# Altium project Balance_car.PrjPcb
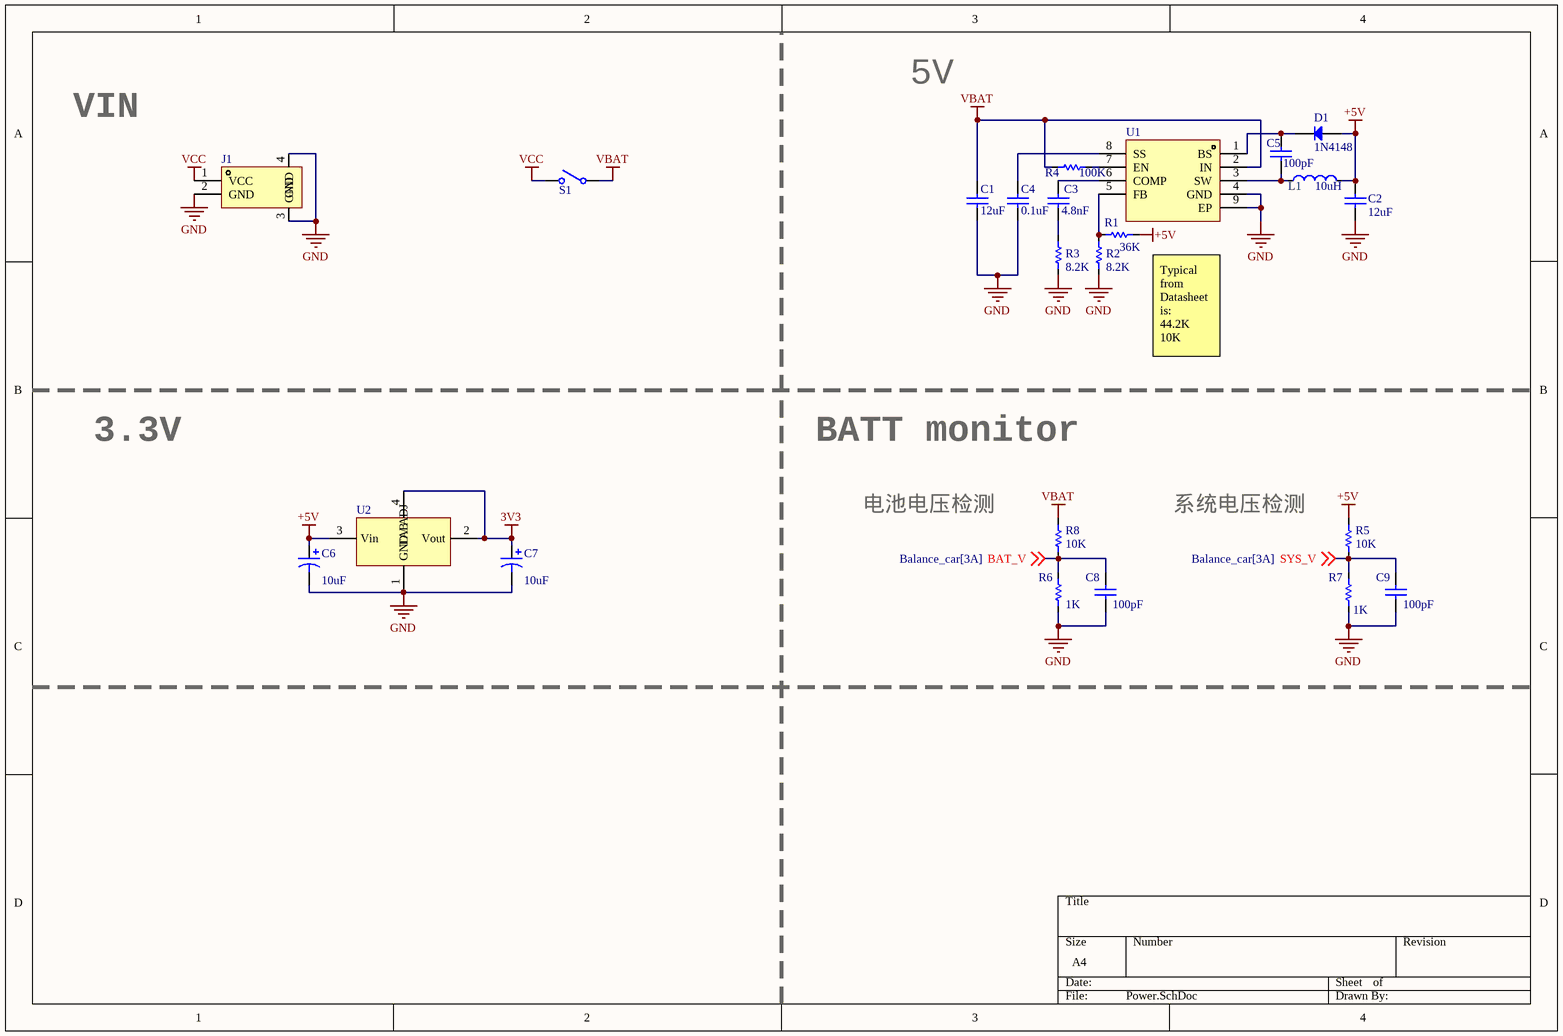
[diagram p0: Power.SchDoc]
2 sheets, 46 parts. Net scope: global (net labels, ports and power ports of the same name join across sheets).
Board file: Balance_car.PcbDoc
Sheets:
  Power.SchDoc
  Balance_car.SchDoc

## Sheet Power.SchDoc
size A4; SheetNumber: 1; SheetTotal: 2

### Parts
C1  value 12uF  [C1206]  (hidden comment: Cap)
C2  value 12uF  [C1206]  (hidden comment: Cap)
C3  value 4.8nF  [C0603]  (hidden comment: Cap)
C4  value 0.1uF  [C0603]  (hidden comment: Cap)
C5  value 100pF  [C0603]  (hidden comment: Cap)
C6  value 10uF  [CAP-SMD_BD4.0-L4.3-W4.3-FD-LS5.3]  (hidden comment: Cap Pol)
C7  value 10uF  [CAP-SMD_BD4.0-L4.3-W4.3-FD-LS5.3]  (hidden comment: Cap Pol)
C8  value 100pF  [C0603]  (hidden comment: Cap)
C9  value 100pF  [C0603]  (hidden comment: Cap)
D1  1N4148  [SOD-123F]
J1  XT60PW-M  [XT60PW-M]  (value not drawn)
L1  10uH  [IND-SMD_L7.3-W6.6]
R1  value 36K  [R0402]  (hidden comment: Res)
R2  value 8.2K  [R0402]  (hidden comment: Res)
R3  value 8.2K  [R0603]  (hidden comment: Res)
R4  value 100K  [R0603]  (hidden comment: Res)
R5  value 10K  [R0402]  (hidden comment: Res)
R6  value 1K  [R0402]  (hidden comment: Res)
R7  value 1K  [R0402]  (hidden comment: Res)
R8  value 10K  [R0402]  (hidden comment: Res)
S1  SW-PB  [SW-PB]  (value not drawn)
U1  MP2307  [MP2307]  (value not drawn)
U2  1117  [SOT-223-3]  (value not drawn)

### Nets
3V3: C7.1 U2.2(Vout) U2.4(TAB)
+5V: C2.1 C6.1 D1.2(A) L1.2 R1.1 R5.1 U2.3(Vin)
GND: C1.1 C2.2 C4.1 C6.2 C7.2 C8.2 C9.2 J1.2(GND) J1.3(GND) J1.4(GND) R2.1 R3.1 R6.2 R7.2 U1.4(GND) U1.9(EP) U2.1(GND_/_ADJ)
VBAT: C1.2 R4.1 R8.1 S1.1(COMMON) U1.2(IN)
VCC: J1.1(VCC) S1.2(NO)
BAT_V: C8.1 R6.1 R8.2 ; off-sheet BAT_V
SYS_V: C9.1 R5.2 R7.1 ; off-sheet SYS_V
NetC3_1: C3.1 R3.2
NetC3_2: C3.2 U1.6(COMP)
NetC4_2: C4.2 U1.8(SS)
NetC5_1: C5.1 L1.1 U1.3(SW)
NetC5_2: C5.2 D1.1(K) U1.1(BS)
NetR1_2: R1.2 R2.2 U1.5(FB)
NetR4_2: R4.2 U1.7(EN)

### Notes on the sheet
- 5V
- VIN
- (near R1) Typical from Datasheet is:
  44.2K    10K
- 3.3V
- BATT monitor
- 电池电压检测
- 系统电压检测

### Library data of the parts
C1-C5 C8 C9 = Cap: Capacitor; Published: 8-Jun-2000; LatestRevisionDate: 17-Jul-2002; LatestRevisionNote: Re-released for DXP Platform.; PackageReference: RAD-0.3; Publisher: Altium Limited; PackageDescription: Radial Cap, Thru-Hole; 2 Leads; 0.3 in Pin Spacing
C6 C7 = Cap Pol: Polarized Capacitor (Axial); Published: 8-Jun-2000; LatestRevisionDate: 17-Jul-2002; LatestRevisionNote: Re-released for DXP Platform.; PackageReference: POLAR0.8; Publisher: Altium Limited; PackageDescription: Polarized Capacitor; 2 Leads
D1 = 1N4148: High Conductance Fast Diode; Published: 8-Jun-2000; LatestRevisionDate: 17-Jul-2002; LatestRevisionNote: Re-released for DXP Platform.; DatasheetVersion: 1997; PackageReference: DO-35; Publisher: Altium Limited; PackageDescription: Diode, Axial; Body 3.8 x 1.9 mm (LxDia. max), Lead Dia. 0.53 mm (max); Code_JEDEC: DO-204-AH; ComponentLink1Description: Manufacturer Link; ComponentLink1URL: http://www.fairchildsemi.com/; ComponentLink2Description: Datasheet; ComponentLink2URL: http://www.fairchildsemi.com/ds/1N%2F1N4148.pdf
L1 = IND-SMD_L7.3-W6.6: 电感值:10uH;精度:±20%;额定电流:4A;饱和电流(Isat):5.5A;直流电阻(DCR):62mΩ;; Manufacturer: PSA(信昌电陶); Symbol: MCS0630-100MPY1; Add into BOM: yes; Tolerance: ±20%; Rated Current: 4A; Saturation Current (Isat): 5.5A; DC Resistance (DCR): 62mΩ; Name: 10uH; Device: MCS0630-100MPY1; LCSC Part Name: 10uH ±20% 4A 62mΩ; Supplier Part: C2937094; Manufacturer Part: MCS0630-100MPY1; Supplier Footprint: 0630; JLCPCB Part Class: Extended Part; Datasheet: https://atta.szlcsc.com/upload/public/pdf/source/20220121/EA6E6E6F70ED7BAE67EC293805EAAACB.pdf; Supplier: LCSC; Convert to PCB: yes; Value: 10uH
R1-R8 = Res: Resistor; Published: 8-Jun-2000; LatestRevisionDate: 17-Jul-2002; LatestRevisionNote: Re-released for DXP Platform.; PackageReference: AXIAL-0.3; Publisher: Altium Limited; PackageDescription: Axial Device, Thru-Hole; 2 Leads; 0.3 in Pin Spacing
S1 = SW-PB: 船型开关; Published: 24-Mar-1999; LatestRevisionDate: 17-Jul-2002; LatestRevisionNote: Re-released for DXP Platform.; PackageReference: SPST-2; Publisher: Altium Limited; PackageDescription: Switch; 2 Leads

## Sheet Balance_car.SchDoc
size A4; SheetNumber: 2; SheetTotal: 2
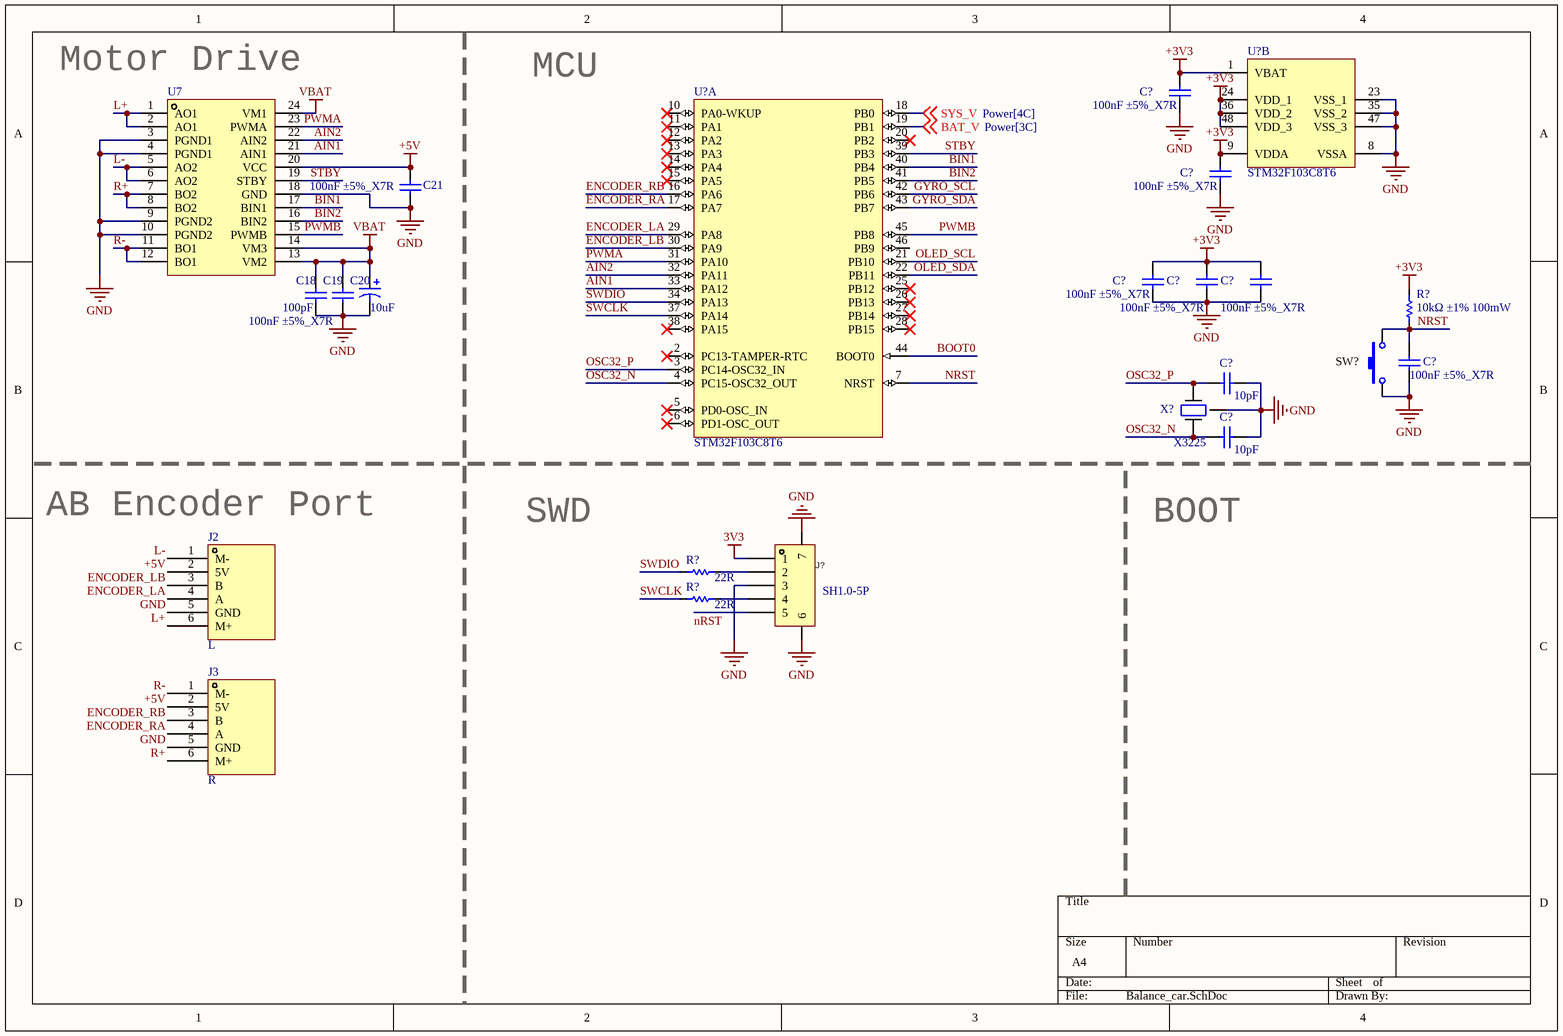
[diagram p1: Balance_car.SchDoc]

### Parts
(Parts that share a designator on the sheet are numbered #1, #2 ... from top to bottom, then left to right.)
C18  value 100pF  [C0603]  (hidden comment: Cap)
C19  100nF ±5%_X7R  [C0603]
C20  value 10uF  [CAP-SMD_L3.5-W2.8-R-RD]  (hidden comment: Cap Pol)
C21  100nF ±5%_X7R  [C0603]
C?#1  100nF ±5%_X7R  [C0603]
C?#2  100nF ±5%_X7R  [C0603]
C?#3  100nF ±5%_X7R  [C0603]
C?#4  100nF ±5%_X7R  [C0603]
C?#5  100nF ±5%_X7R  [C0603]
C?#6  100nF ±5%_X7R  [C0603]
C?#7  value 10pF  [C0603]  (hidden comment: Cap)
C?#8  value 10pF  [C0603]  (hidden comment: Cap)
J2  L  [AB_Encoder]
J3  R  [AB_Encoder]
J?  SH1.0-5P  [SM05B-SRSS-TB-LF-SN]
R?#1  10kΩ ±1% 100mW  [R0603]
R?#2  22R  [R0402]
R?#3  22R  [R0402]
SW?  TS-1185-B-A-B-A  [SW-SMD_L4.0-W3.0-LS5.0]  (value not drawn)
U7  TB6612FNG  [SSOP-24_L8.3-W5.6-P0.65-LS7.6-BL]  (value not drawn)
U?#1  STM32F103C8T6  [STM-LQFP48_N]  (part B of 2)
U?#2  STM32F103C8T6  [STM-LQFP48_N]  (part A of 2)
X?  X3225  [CRYSTAL_3225]

### Nets
3V3: J?.1
+3V3: C?#1.2 C?#2.2 C?#3.2 C?#4.2 C?#5.2 R?#1.2 U?#1.1(VBAT) U?#1.9(VDDA) U?#1.24(VDD_1) U?#1.36(VDD_2) U?#1.48(VDD_3)
+5V: C21.2 J2.2(5V) J3.2(5V) U7.20(VCC)
GND: C18.1 C19.1 C20.2 C21.1 C?#1.1 C?#2.1 C?#3.1 C?#4.1 C?#5.1 C?#6.1 C?#7.1 C?#8.1 J2.5(GND) J3.5(GND) J?.3 J?.6 J?.7 SW?.1 U7.3(PGND1) U7.4(PGND1) U7.9(PGND2) U7.10(PGND2) U7.18(GND) U?#1.8(VSSA) U?#1.23(VSS_1) U?#1.35(VSS_2) U?#1.47(VSS_3) X?.G
VBAT: C18.2 C19.2 C20.1 U7.13(VM2) U7.14(VM3) U7.24(VM1)
AIN1: U7.21(AIN1) U?#2.33(PA12)
AIN2: U7.22(AIN2) U?#2.32(PA11)
BAT_V: U?#2.19(PB1) ; off-sheet BAT_V
BIN1: U7.17(BIN1) U?#2.40(PB4)
BIN2: U7.16(BIN2) U?#2.41(PB5)
BOOT0: U?#2.44(BOOT0)
ENCODER_LA: J2.4(A) U?#2.29(PA8)
ENCODER_LB: J2.3(B) U?#2.30(PA9)
ENCODER_RA: J3.4(A) U?#2.17(PA7)
ENCODER_RB: J3.3(B) U?#2.16(PA6)
GYRO_SCL: U?#2.42(PB6)
GYRO_SDA: U?#2.43(PB7)
L+: J2.6(M+) U7.1(AO1) U7.2(AO1)
L-: J2.1(M-) U7.5(AO2) U7.6(AO2)
NRST: C?#6.2 J?.5 R?#1.1 SW?.2 U?#2.7(NRST)
OLED_SCL: U?#2.21(PB10)
OLED_SDA: U?#2.22(PB11)
OSC32_N: C?#8.2 U?#2.4(PC15-OSC32_OUT) X?.1
OSC32_P: C?#7.2 U?#2.3(PC14-OSC32_IN) X?.3
PWMA: U7.23(PWMA) U?#2.31(PA10)
PWMB: U7.15(PWMB) U?#2.45(PB8)
R+: J3.6(M+) U7.7(BO2) U7.8(BO2)
R-: J3.1(M-) U7.11(BO1) U7.12(BO1)
STBY: U7.19(STBY) U?#2.39(PB3)
SWCLK: R?#3.2 U?#2.37(PA14)
SWDIO: R?#2.2 U?#2.34(PA13)
SYS_V: U?#2.18(PB0) ; off-sheet SYS_V
NetJ?_2: J?.2 R?#2.1
NetJ?_4: J?.4 R?#3.1

Not connected (* = marked no-connect by the designer): U?#2 2(PC13-TAMPER-RTC)* 5(PD0-OSC_IN)* 6(PD1-OSC_OUT)* 10(PA0-WKUP)* 11(PA1)* 12(PA2)* 13(PA3)* 14(PA4)* 15(PA5)* 20(PB2)* 25(PB12)* 26(PB13)* 27(PB14)* 28(PB15)* 38(PA15)* 46(PB9)

### Notes on the sheet
- (near U7) Motor Drive
- MCU
- (near J2) AB Encoder Port
- SWD
- BOOT

### Library data of the parts
C18 C19 C21 C?#1-C?#8 = Cap: Capacitor; Published: 8-Jun-2000; LatestRevisionDate: 17-Jul-2002; LatestRevisionNote: Re-released for DXP Platform.; PackageReference: RAD-0.3; Publisher: Altium Limited; PackageDescription: Radial Cap, Thru-Hole; 2 Leads; 0.3 in Pin Spacing
C20 = Cap Pol: Polarized Capacitor (Axial); Published: 8-Jun-2000; LatestRevisionDate: 17-Jul-2002; LatestRevisionNote: Re-released for DXP Platform.; PackageReference: POLAR0.8; Publisher: Altium Limited; PackageDescription: Polarized Capacitor; 2 Leads
J2 J3 = AB_Encoder: 带编码器 TT马达
J? = SH1.0-5P: CONN-SMD_5P-P1.25_532610571-2; Manufacturer: BOOMELE(博穆精密); Name: GH1.25-5PLTPZ; Add into BOM: yes; Symbol: GH1.25-5PLTPZ; Device: GH1.25-5PLTPZ; LCSC Part Name: GH1.25-5P立贴编带加盖; Supplier Part: C2829263; Manufacturer Part: GH1.25-5PLTPZ; Supplier Footprint: -; JLCPCB Part Class: Extended Part; Datasheet: https://atta.szlcsc.com/upload/public/pdf/source/20211125/08A09A4909F58AF780B71FE423A00F7E.pdf; Supplier: LCSC; Convert to PCB: yes
R?#1-R?#3 = Res: Resistor; Published: 8-Jun-2000; LatestRevisionDate: 17-Jul-2002; LatestRevisionNote: Re-released for DXP Platform.; PackageReference: AXIAL-0.3; Publisher: Altium Limited; PackageDescription: Axial Device, Thru-Hole; 2 Leads; 0.3 in Pin Spacing
SW? = Button: 触点电流：50mA 额定电压(DC)：12V 电路结构：单刀单掷 安装方式：立贴 带灯：无 作用力：160gf 机械寿命：10万次 带支架：否 轻触开关3x4x2贴片2脚小龟 160gf; Manufacturer: XKB Connectivity(中国星坤); Add into BOM: yes; Contact Current: 50mA; Voltage Rating (DC): 12V; Circuit: 单刀单掷; Actuator Style: 圆形按钮; Actuator/Cap Color: 黑色; With Lamp: 无; Mechanical Life: 10万次; Switch Length: 4mm; Switch Width: 3mm; Switch Height: 2mm; Strike Gundam: 否; Name: TS-1185-B-A-B-A; Symbol: TS-1185-B-A-B-A; Device: TS-1185-B-A-B-A; LCSC Part Name: 4*3*2mm 立贴 轻触开关; Supplier Part: C561517; Manufacturer Part: TS-1185-B-A-B-A; Supplier Footprint: SMD; JLCPCB Part Class: Extended Part; Datasheet: https://atta.szlcsc.com/upload/public/pdf/source/20211011/C2F26DC0AE1820400F54DBF49644F5A1.pdf; Supplier: LCSC; Convert to PCB: yes; Insulation Resistance: -; Mounting Style: 立贴; Operating Force: 160gf; Operating Temperature: -30℃~+85℃
U7 = TB6612FNG: Driver IC for Dual DC motor / SSOP24-P-300-0.65A
U?#1 U?#2 = STM32F103C8T6: ARM Cortex-M3 32-bit MCU, 64 KB Flash, 20 KB Internal RAM, 37 I/Os, 48-pin LQFP, -40 to 85 degC, Tray; A/D Converter: 2x12-bit (10 Channel); FLASH Size (Prog) (kB): 64; I/Os (High Current): 37; Internal RAM Size (kB): 20; Operating Frequency(F) (Processor speed) (MHz): 72; Supply Voltage(Vcc) min (V): 2; DatasheetVersion: Rev. 16; PackageVersion: Rev. 6, 06/2013; PackageReference: LQFP48; PackageDescription: 48-Pin Low Profile Quad Flat Package, 7 x 7 mm Body, 0.5 mm Pitch; Supplier 1: Digi-Key; Supplier Part Number 1: 497-6063-ND; Supplier 2: Farnell; Supplier Part Number 2: 1447637; Supplier 3: Newark; Supplier Part Number 3: 59M2182; Supplier 4: Newark; Supplier Part Number 4: 57P1222; Supplier 5: Mouser; Supplier Part Number 5: 511-STM32F103C8T6; Core: ARM Cortex-M3; Packing: Tray; Mounting Technology: Surface Mount; PartNumber: STM32F103C8T6; ComponentLink1Description: Manufacturer URL; ComponentLink1URL: http://www.st.com/web/en/home.html; ComponentLink2Description: Datasheet; ComponentLink2URL: http://www.st.com/st-web-ui/static/active/en/resource/technical/document/datasheet/CD00161566.pdf; ComponentLink3Description: Package Specification; ComponentLink3URL: http://www.st.com/st-web-ui/static/active/en/resource/technical/document/datasheet/DM00058181.pdf
X? = X3225: Crystal 8MHz ±10ppm 10pF 200 Ohm -10°C ~ 60°C Surface Mount 4-SMD, No Lead (DFN, LCC); Manufacturer: Abracon LLC; Manufacturer Part Number: ABM3B-8.000MHZ-10-1-U-T; Operating Mode: Fundamental; Supplier 1: Digi-Key; Supplier Part Number 1: 535-9721-1-ND; RoHS: RoHS Compliant; Category: Crystals, Oscillators, Resonators; Stock: 35437; Pricing 1: 1=0.69, 10=0.578, 50=0.5198, 100=0.462, 500=0.4389 (USD); Packaging: Cut Tape (CT); Part Status: Active; Type: MHz Crystal; Frequency Stability: ±10ppm; Frequency Tolerance: ±10ppm; Load Capacitance: 10pF; Operating Temperature: -10°C ~ 60°C; Ratings: -; Mounting Type: Surface Mount; Package / Case: 4-SMD, No Lead; Size / Dimension: 0.197" L x 0.126" W (5.00mm x 3.20mm); Height - Seated (Max): 0.043" (1.10mm); ComponentLink1URL: http://www.abracon.com/Resonators/abm3b.pdf; ComponentLink1Description: http://www.abracon.com/Resonators/abm3b.pdf; Supplier 2: Digi-Key; Supplier Part Number 2: 535-9721-2-ND; Pricing 2: 1000=0.336, 3000=0.315, 5000=0.3045, 10000=0.294 (USD)

## Nets that join several sheets
3V3: Power (C7.1 U2.2 U2.4), Balance_car (J?.1)
+5V: Power (7 pins), Balance_car (C21.2 J2.2 J3.2 U7.20)
GND: Power (17 pins), Balance_car (28 pins)
VBAT: Power (5 pins), Balance_car (6 pins)
BAT_V: Power (C8.1 R6.1 R8.2), Balance_car (U?#2.19)
SYS_V: Power (C9.1 R5.2 R7.1), Balance_car (U?#2.18)